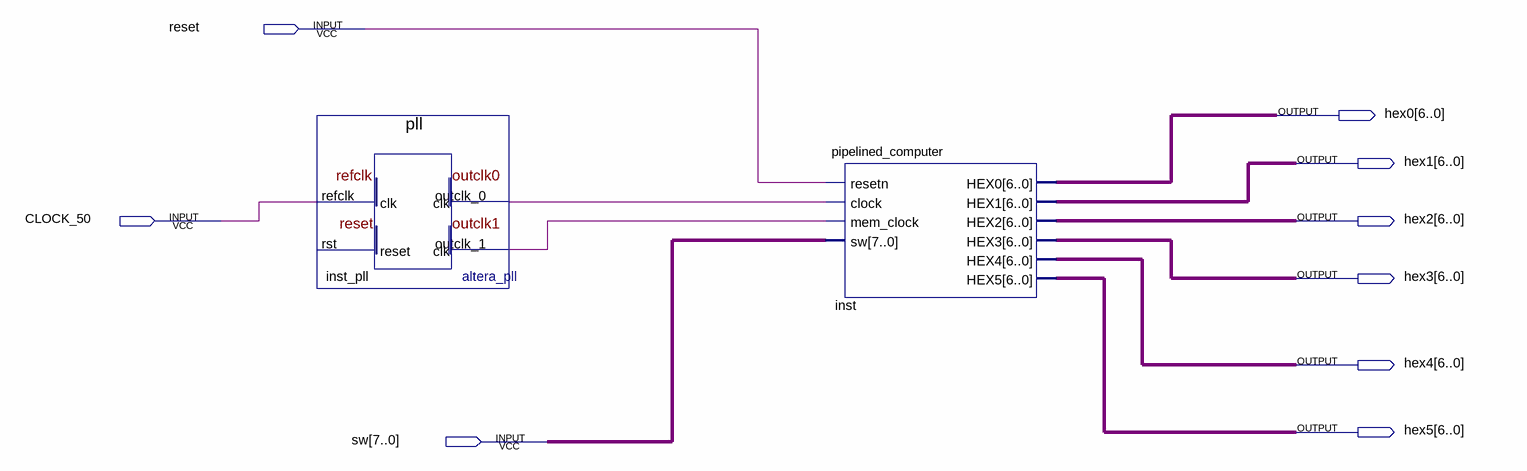
[diagram p0: schematic sheet]
// Quartus schematic pl_computer.bdf as structural Verilog: 2 symbols, 9 pins
module pl_computer (
  input  reset,
  input  CLOCK_50,
  input  [7:0] sw,
  output [6:0] hex0,
  output [6:0] hex1,
  output [6:0] hex2,
  output [6:0] hex3,
  output [6:0] hex4,
  output [6:0] hex5
);

  wire inst_pll_outclk_0, inst_pll_outclk_1;

  pll inst_pll (.refclk(CLOCK_50), .outclk_0(inst_pll_outclk_0), .outclk_1(inst_pll_outclk_1));  // open: rst
  pipelined_computer inst (
    .resetn(reset), .clock(inst_pll_outclk_0), .mem_clock(inst_pll_outclk_1), .sw(sw), .HEX0(hex0),
    .HEX1(hex1), .HEX2(hex2), .HEX3(hex3), .HEX4(hex4), .HEX5(hex5));
endmodule
